# EasyEDA Pro project ProPrj_DiscoTech 6 Current_2026-05-06.epro, schematic Cue

## Sheets
1 Cue: Board Name: Cue; Create Date: 2025-11-03; Page Name: Cue; Project Name: DiscoTech 6 Current; Schematic Name: Cue; Update Date: 2025-11-16; Company: EasyEDA.com; Page Size: A4; Version: V1.0
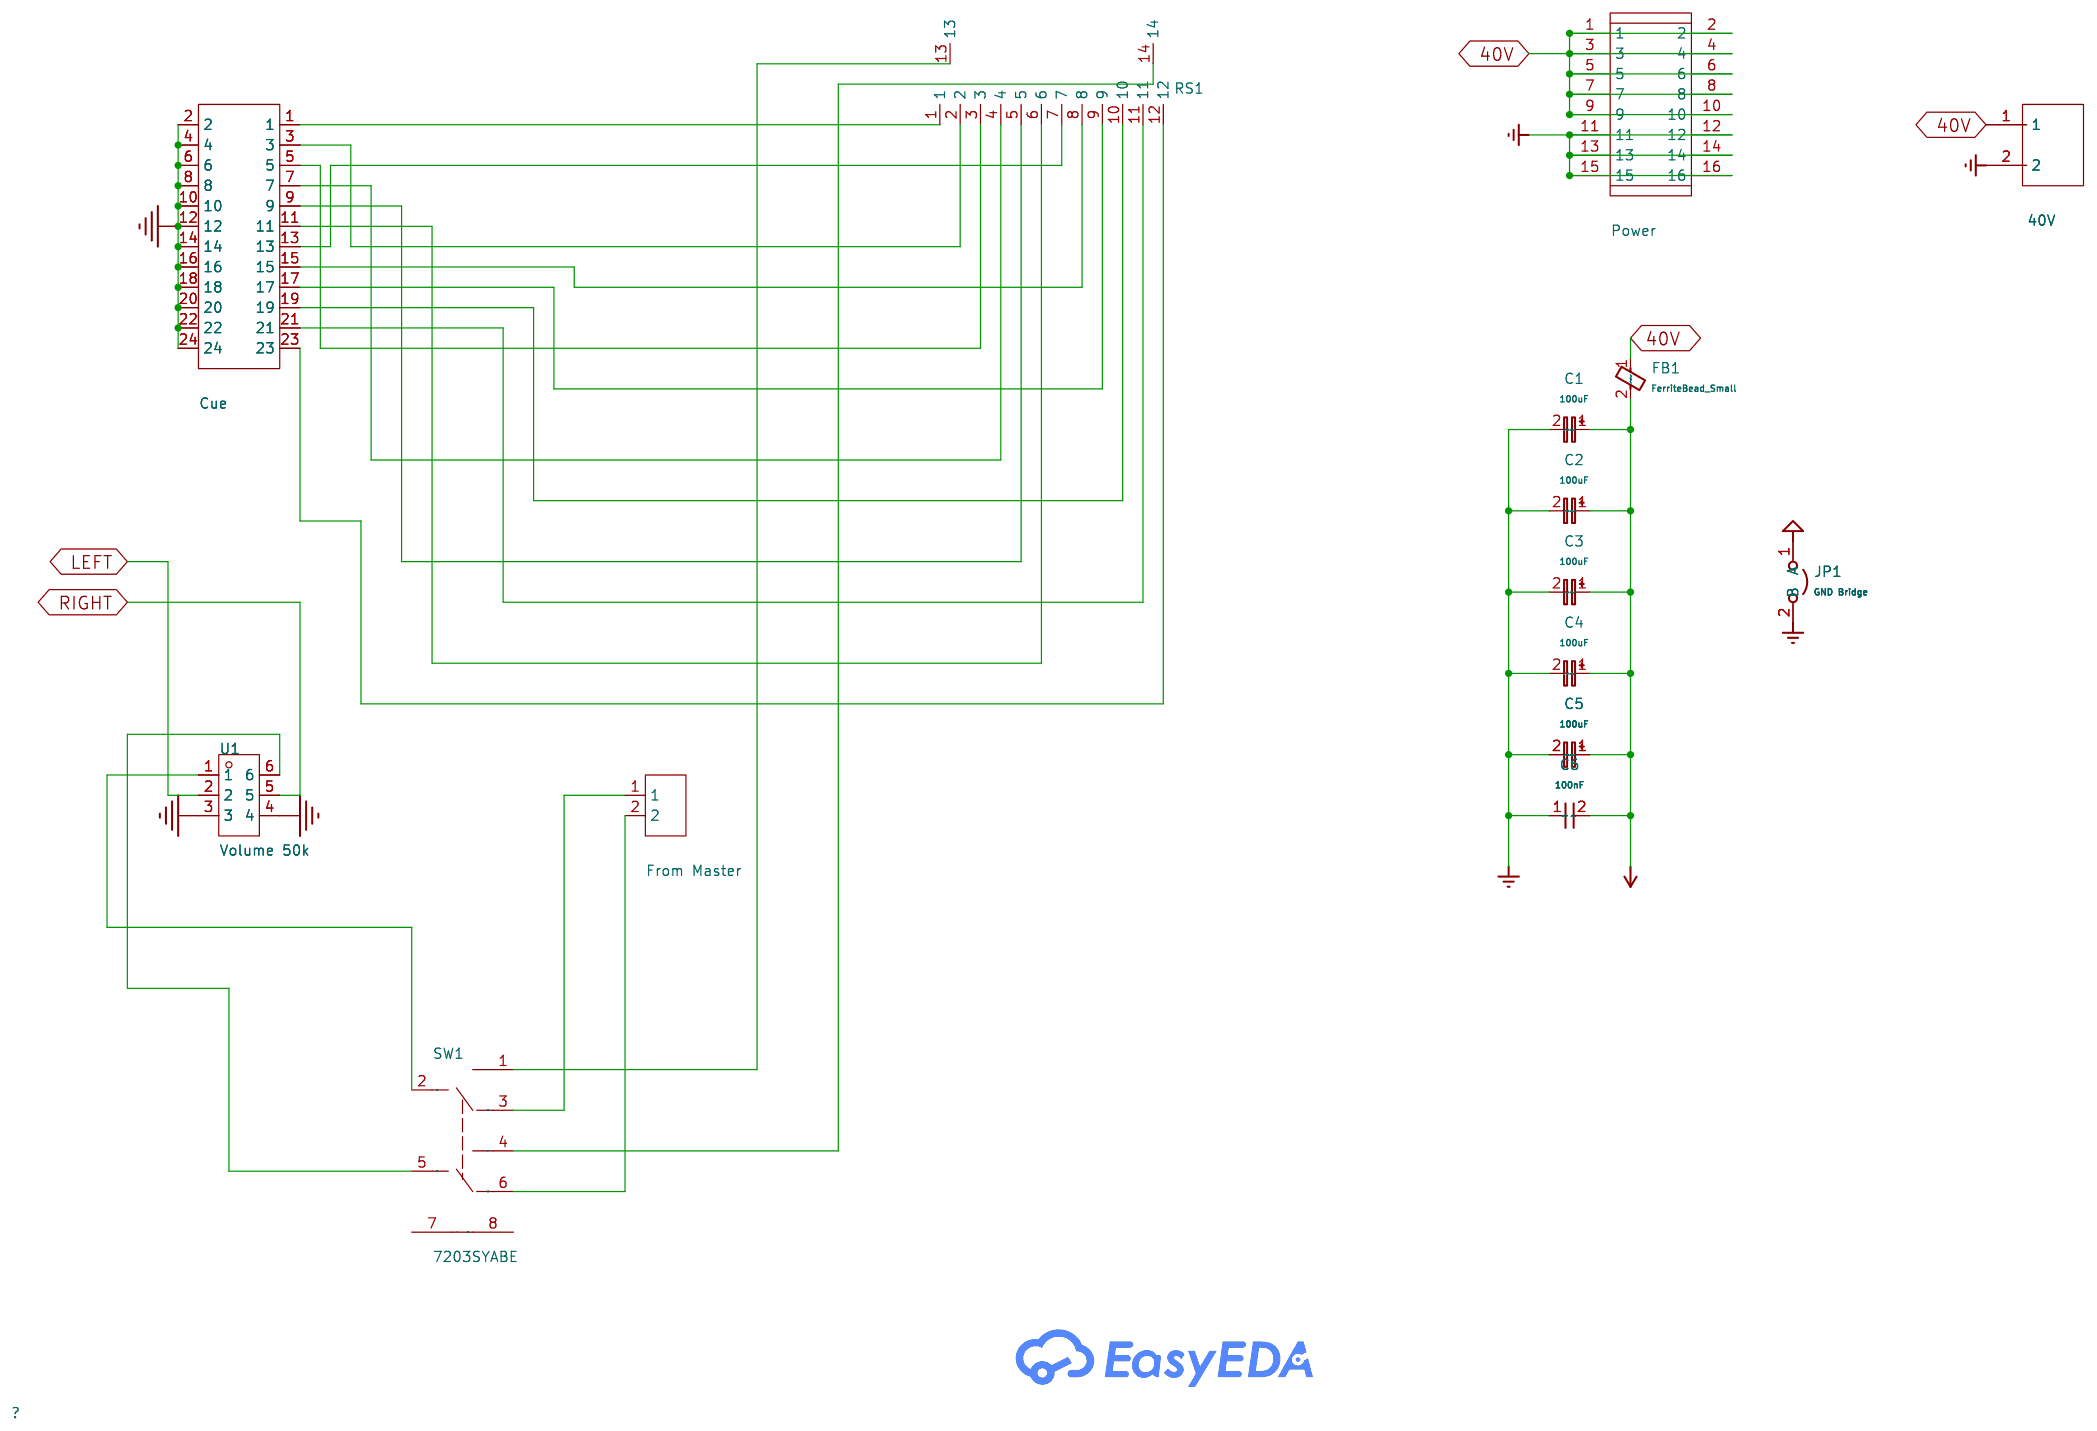
[diagram p4: Cue]
2 Amp: Create Date: 2025-11-04; Page Name: Amp; Update Date: 2026-04-02
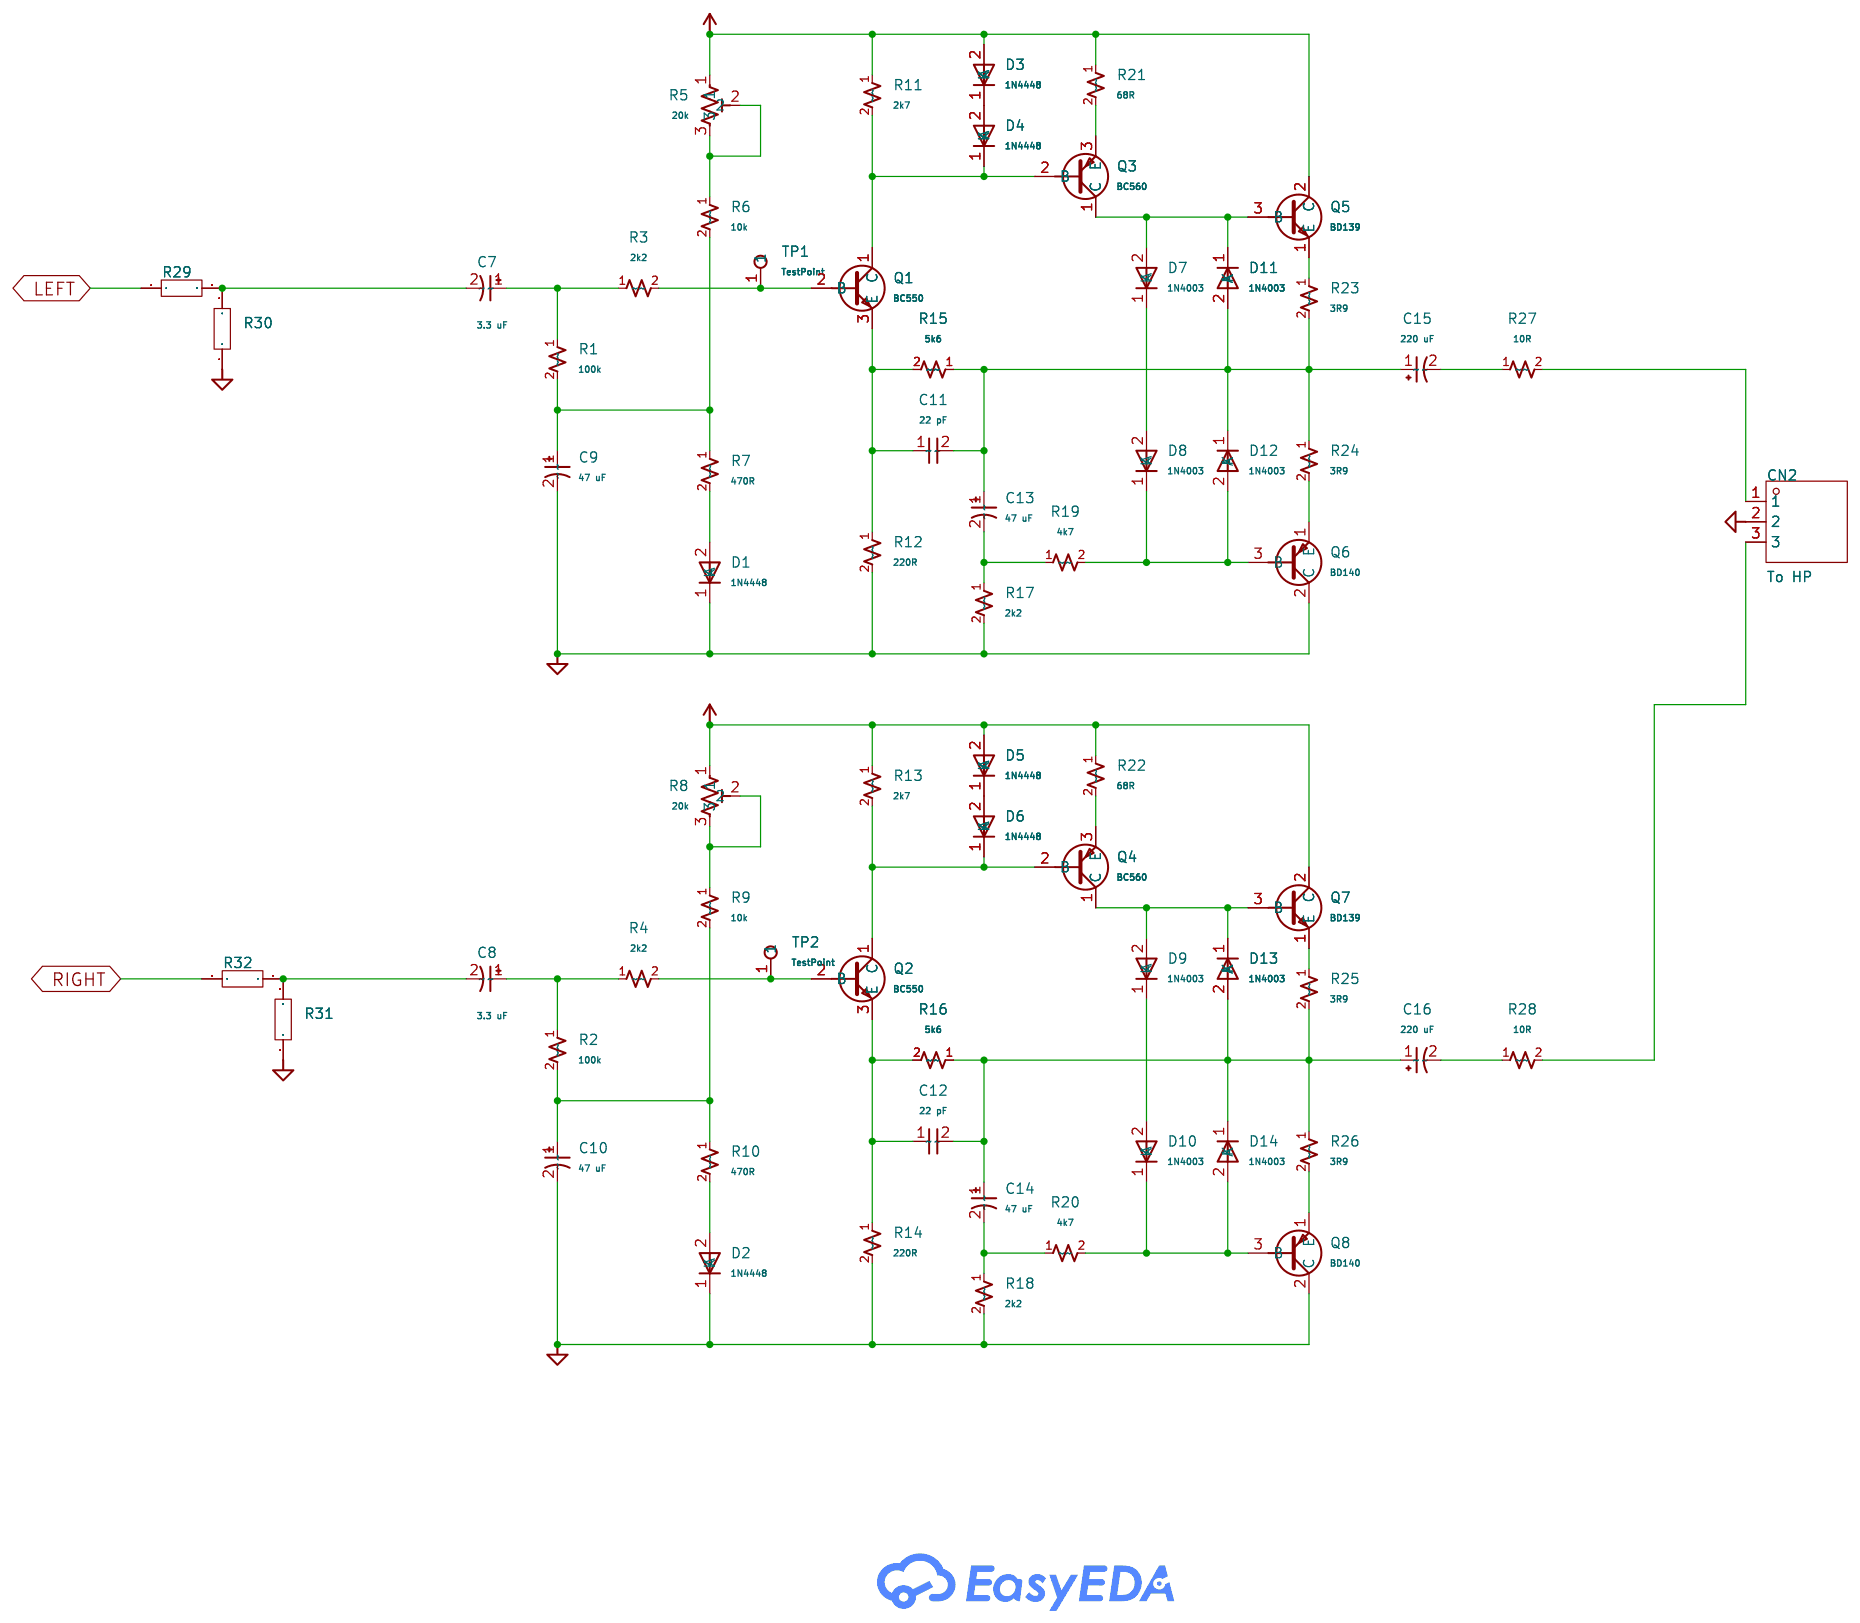
[diagram p5: Amp]

## Parts
sheet Amp
C7  3.3 uF  [Capacitor_THT:CP_Radial_Tantal_D5.0mm_P5.00mm]
C8  3.3 uF  [Capacitor_THT:CP_Radial_Tantal_D5.0mm_P5.00mm]
C9  47 uF  [Capacitor_THT:CP_Radial_D6.3mm_P2.50mm]
C10  47 uF  [Capacitor_THT:CP_Radial_D6.3mm_P2.50mm]
C11  22 pF  [Capacitor_THT:C_Disc_D3.8mm_W2.6mm_P2.50mm]
C12  22 pF  [Capacitor_THT:C_Disc_D3.8mm_W2.6mm_P2.50mm]
C13  47 uF  [Capacitor_THT:CP_Radial_D6.3mm_P2.50mm]
C14  47 uF  [Capacitor_THT:CP_Radial_D6.3mm_P2.50mm]
C15  220 uF  [Capacitor_THT:CP_Radial_D10.0mm_P5.00mm]
C16  220 uF  [Capacitor_THT:CP_Radial_D10.0mm_P5.00mm]
CN2  To HP  [CONN-TH_B3P-VH-LF-SN]
D1  1N4448  [Diode_THT:D_DO-35_SOD27_P7.62mm_Horizontal]
D2  1N4448  [Diode_THT:D_DO-35_SOD27_P7.62mm_Horizontal]
D3  1N4448  [Diode_THT:D_DO-35_SOD27_P7.62mm_Horizontal]
D4  1N4448  [Diode_THT:D_DO-35_SOD27_P7.62mm_Horizontal]
D5  1N4448  [Diode_THT:D_DO-35_SOD27_P7.62mm_Horizontal]
D6  1N4448  [Diode_THT:D_DO-35_SOD27_P7.62mm_Horizontal]
D7  1N4003  [Diode_THT:D_DO-41_SOD81_P10.16mm_Horizontal]
D8  1N4003  [Diode_THT:D_DO-41_SOD81_P10.16mm_Horizontal]
D9  1N4003  [Diode_THT:D_DO-41_SOD81_P10.16mm_Horizontal]
D10  1N4003  [Diode_THT:D_DO-41_SOD81_P10.16mm_Horizontal]
D11  1N4003  [Diode_THT:D_DO-41_SOD81_P10.16mm_Horizontal]
D12  1N4003  [Diode_THT:D_DO-41_SOD81_P10.16mm_Horizontal]
D13  1N4003  [Diode_THT:D_DO-41_SOD81_P10.16mm_Horizontal]
D14  1N4003  [Diode_THT:D_DO-41_SOD81_P10.16mm_Horizontal]
Q1  BC550  [TO-92-3_L4.8-W3.7-P2.60-L_LP0003A]
Q2  BC550  [TO-92-3_L4.8-W3.7-P2.60-L_LP0003A]
Q3  BC560  [TO-92-3_L4.8-W3.7-P2.60-L_LP0003A]
Q4  BC560  [TO-92-3_L4.8-W3.7-P2.60-L_LP0003A]
Q5  BD139  [Package_TO_SOT_THT:TO-126-3_Vertical]
Q6  BD140  [Package_TO_SOT_THT:TO-126-3_Vertical]
Q7  BD139  [Package_TO_SOT_THT:TO-126-3_Vertical]
Q8  BD140  [Package_TO_SOT_THT:TO-126-3_Vertical]
R1  100k  [Resistor_THT:R_Axial_DIN0207_L6.3mm_D2.5mm_P7.62mm_Horizontal]
R2  100k  [Resistor_THT:R_Axial_DIN0207_L6.3mm_D2.5mm_P7.62mm_Horizontal]
R3  2k2  [Resistor_THT:R_Axial_DIN0207_L6.3mm_D2.5mm_P7.62mm_Horizontal]
R4  2k2  [Resistor_THT:R_Axial_DIN0207_L6.3mm_D2.5mm_P7.62mm_Horizontal]
R5  20k  [Potentiometer_THT:Potentiometer_Bourns_3296W_Vertical]
R6  10k  [Resistor_THT:R_Axial_DIN0207_L6.3mm_D2.5mm_P7.62mm_Horizontal]
R7  470R  [Resistor_THT:R_Axial_DIN0207_L6.3mm_D2.5mm_P7.62mm_Horizontal]
R8  20k  [Potentiometer_THT:Potentiometer_Bourns_3296W_Vertical]
R9  10k  [Resistor_THT:R_Axial_DIN0207_L6.3mm_D2.5mm_P7.62mm_Horizontal]
R10  470R  [Resistor_THT:R_Axial_DIN0207_L6.3mm_D2.5mm_P7.62mm_Horizontal]
R11  2k7  [Resistor_THT:R_Axial_DIN0207_L6.3mm_D2.5mm_P7.62mm_Horizontal]
R12  220R  [Resistor_THT:R_Axial_DIN0207_L6.3mm_D2.5mm_P7.62mm_Horizontal]
R13  2k7  [Resistor_THT:R_Axial_DIN0207_L6.3mm_D2.5mm_P7.62mm_Horizontal]
R14  220R  [Resistor_THT:R_Axial_DIN0207_L6.3mm_D2.5mm_P7.62mm_Horizontal]
R15  5k6  [Resistor_THT:R_Axial_DIN0207_L6.3mm_D2.5mm_P7.62mm_Horizontal]
R16  5k6  [Resistor_THT:R_Axial_DIN0207_L6.3mm_D2.5mm_P7.62mm_Horizontal]
R17  2k2  [Resistor_THT:R_Axial_DIN0207_L6.3mm_D2.5mm_P7.62mm_Horizontal]
R18  2k2  [Resistor_THT:R_Axial_DIN0207_L6.3mm_D2.5mm_P7.62mm_Horizontal]
R19  4k7  [Resistor_THT:R_Axial_DIN0207_L6.3mm_D2.5mm_P7.62mm_Horizontal]
R20  4k7  [Resistor_THT:R_Axial_DIN0207_L6.3mm_D2.5mm_P7.62mm_Horizontal]
R21  68R  [Resistor_THT:R_Axial_DIN0207_L6.3mm_D2.5mm_P7.62mm_Horizontal]
R22  68R  [Resistor_THT:R_Axial_DIN0207_L6.3mm_D2.5mm_P7.62mm_Horizontal]
R23  3R9  [Resistor_THT:R_Axial_DIN0309_L9.0mm_D3.2mm_P12.70mm_Horizontal]
R24  3R9  [Resistor_THT:R_Axial_DIN0309_L9.0mm_D3.2mm_P12.70mm_Horizontal]
R25  3R9  [Resistor_THT:R_Axial_DIN0309_L9.0mm_D3.2mm_P12.70mm_Horizontal]
R26  3R9  [Resistor_THT:R_Axial_DIN0309_L9.0mm_D3.2mm_P12.70mm_Horizontal]
R27  10R  [Resistor_THT:R_Axial_DIN0414_L11.9mm_D4.5mm_P15.24mm_Horizontal]
R28  10R  [Resistor_THT:R_Axial_DIN0414_L11.9mm_D4.5mm_P15.24mm_Horizontal]
R29  10K  [Resistor_THT:R_Axial_DIN0207_L6.3mm_D2.5mm_P7.62mm_Horizontal]
R30  10K  [Resistor_THT:R_Axial_DIN0207_L6.3mm_D2.5mm_P7.62mm_Horizontal]
R31  10K  [Resistor_THT:R_Axial_DIN0207_L6.3mm_D2.5mm_P7.62mm_Horizontal]
R32  10K  [Resistor_THT:R_Axial_DIN0207_L6.3mm_D2.5mm_P7.62mm_Horizontal]
TP1  TestPoint  [Connector_PinHeader_2.54mm:PinHeader_1x01_P2.54mm_Vertical]
TP2  TestPoint  [Connector_PinHeader_2.54mm:PinHeader_1x01_P2.54mm_Vertical]
sheet Cue
C1  100uF  [Capacitor_THT:CP_Radial_D10.0mm_P5.00mm]
C2  100uF  [Capacitor_THT:CP_Radial_D10.0mm_P5.00mm]
C3  100uF  [Capacitor_THT:CP_Radial_D10.0mm_P5.00mm]
C4  100uF  [Capacitor_THT:CP_Radial_D10.0mm_P5.00mm]
C5  100uF  [Capacitor_THT:CP_Radial_D10.0mm_P5.00mm]
C6  100nF  [Capacitor_THT:C_Rect_L7.2mm_W2.5mm_P5.00mm_FKS2_FKP2_MKS2_MKP2]
CN1  From Master  [CONN-TH_2P-P2.50_HX-2.54MM-2P-ZZ-MS]
FB1  FerriteBead_Small  [Inductor_THT:L_Axial_L9.5mm_D4.0mm_P12.70mm_Horizontal_Fastron_SMCC]
JP1  GND Bridge  [Connector_PinHeader_2.54mm:PinHeader_1x02_P2.54mm_Vertical]
P1  Cue  [IDC-TH_24P-P2.54_ZHOURI_DC3-2.54-24PAL]
P2  Power  [CONN-TH_16P-P2.54_C9142]
P4  40V  [CONN-TH_WJ126V-5.0-2P]
RS1  2P6T  [Library:Grayhill 71 series 2P6T Rotary Switch]
SW1  7203SYABE  [SW-TH_7203SYABE]
U1  Volume 50k  [RES-ADJ-TH_RK27112A0A16]

## Library data of the parts
C7-C10 C13-C16 = Device_C_Polarized_Small_US: Polarized capacitor, small US symbol; Users: REF**
C6 C11 C12 = Device_C_Small: Unpolarized capacitor, small symbol; Users: REF**
CN2 = B3P-VH(LF)(SN): Pins Structure:1x3P Pitch:3.96mm Mounting Style:Direct Insert Reference Series:VH Number of Pins:3P Number of Rows:1 Number of PINs Per Row:3 Row Spacing:- Current Rating (Max):10A Contact Material:Brass Contact Plating:Tin Operating Temperature Range:-25; LCSC Part Name: 1x3P 间距:3.96mm 直插 系列:VH; Supplier Part: C160316; Manufacturer: JST; Supplier Footprint: 插件,P=3.96mm; JLCPCB Part Class: Extended Part; Datasheet: https://atta.szlcsc.com/upload/public/pdf/source/20181223/C160316_7785062CEF1934DB27BD79CEB62E0E2D.pdf; Supplier: LCSC; Pins Structure: 1x3P; Pitch: 3.96mm; Mounting Style: Direct Insert; Reference Series: VH; Number of Pins: 3P; Number of Rows: 1; Number of PINs Per Row: 3; Current Rating (Max): 10A; Contact Material: Brass; Contact Plating: Tin; Operating Temperature Range: -25℃~+85℃; Rated Voltage (Max): 250V; Plastic Material: PA66; Flame Retardant Rating: UL94V-0; Colour: White; Z-Height of the Board: 9.4mm; X-Length of Bottom Edge on Board (Spacing Line): 11.82mm; Y-Width of Bottom Edge on Board: 8.5mm
D1-D6 = Diode_1N4448: 100V 0.15A High-speed standard diode, DO-35; Users: K; datasheet: https://assets.nexperia.com/documents/data-sheet/1N4148_1N4448.pdf; sim_device: D; sim_pins: 1=K 2=A; User doc link: https://assets.nexperia.com/documents/data-sheet/1N4148_1N4448.pdf; Sim.Device: D; Sim.Pins: 1=K 2=A
D7-D14 = Diode_1N4003: 200V 1A General Purpose Rectifier Diode, DO-41; Users: REF**; datasheet: http://www.vishay.com/docs/88503/1n4001.pdf; sim_device: D; sim_pins: 1=K 2=A; User doc link: http://www.vishay.com/docs/88503/1n4001.pdf; Sim.Device: D; Sim.Pins: 1=K 2=A
Q1 Q2 = Transistor_BJT_BC550: 0.1A Ic, 45V Vce, Small Signal NPN Transistor, TO-92; User doc link: https://www.onsemi.com/pub/Collateral/BC550-D.pdf
Q3 Q4 = Transistor_BJT_BC560: 0.1A Ic, 45V Vce, PNP Small Signal Transistor, TO-92; Users: REF**; datasheet: https://www.onsemi.com/pub/Collateral/BC550-D.pdf; User doc link: https://www.onsemi.com/pub/Collateral/BC556BTA-D.pdf
Q5 Q7 = Transistor_BJT_BD139: 1.5A Ic, 80V Vce, Low Voltage Transistor, TO-126; User doc link: http://www.st.com/internet/com/TECHNICAL_RESOURCES/TECHNICAL_LITERATURE/DATASHEET/CD00001225.pdf
Q6 Q8 = Transistor_BJT_BD140: 1.5A Ic, 80V Vce, Low Voltage Transistor, TO-126; Users: REF**; datasheet: http://www.st.com/internet/com/TECHNICAL_RESOURCES/TECHNICAL_LITERATURE/DATASHEET/CD00001225.pdf; User doc link: http://www.st.com/internet/com/TECHNICAL_RESOURCES/TECHNICAL_LITERATURE/DATASHEET/CD00001225.pdf
R1-R4 R6 R7 R9-R28 = Device_R_Small_US: Resistor, small US symbol; Users: REF**
R5 R8 = Device_R_Potentiometer_Trim_US: Trim-potentiometer, US symbol; Users: REF**
R29-R32 = Res_0603: Supplier Footprint: 0603
TP1 TP2 = Connector_TestPoint: test point; Users: REF**
C1-C5 = Device_C_Polarized_Small: Polarized capacitor, small symbol; Users: REF**
CN1 = HX-XH2.54-2PZZ: Pins Structure:1x2P Pitch:2.54mm Mounting Type:Straight Reference Series:XH Number of Pins:2P Number of Rows:1 Number of PINs Per Row:2 Row Spacing:- Current Rating:3A Contact Material:Brass Contact Plating:Tin Operating Temperature:-25℃~+85℃ Operating Te; LCSC Part Name: 1x2P 间距:2.5mm 直插 系列:XH; Supplier Part: C42391660; Manufacturer: hanxia(韩下); Supplier Footprint: 插件,P=2.5mm; JLCPCB Part Class: Extended Part; Datasheet: https://item.szlcsc.com/datasheet/HX-XH2.54-2PZZ/44326932.html; Supplier: LCSC; Pins Structure: 1x2P; Pitch: 2.54mm; Mounting Type: Straight; Reference Series: XH; Number of Pins: 2P; Number of Rows: 1; Number of PINs Per Row: 2; Current Rating: 3A; Contact Material: Brass; Contact Plating: Tin; Operating Temperature: -25℃~+85℃; Voltage Rating: 250V; Plastic Material: PA66; Flame Retardant Rating: UL94V-0; Color: White
FB1 = Device_FerriteBead_Small: Ferrite bead, small symbol; Users: REF**
JP1 = Jumper_Jumper_2_Open: Jumper, 2-pole, open; Users: REF**
P1 = DS1013-24RSiB-B-0: Connector Type:IDC Header Pitch:2.54mm Number of Positions or Pins:2x12P Holder Type:Right Angle Number of Rows:2 Number of PINs Per Row:12; LCSC Part Name: 2.54mm 2x12P 排数:2 每排P数:12; Supplier Part: C7430325; Manufacturer: CONNFLY; Supplier Footprint: 弯插,P=2.54mm; JLCPCB Part Class: Extended Part; Datasheet: https://item.szlcsc.com/datasheet/DS1013-24RSiB-B-0/8429959.html; Supplier: LCSC; Connector Type: IDC Header; Pitch: 2.54mm; Number of Positions or Pins: 2x12P; Holder Type: Right Angle; Number of Rows: 2; Number of PINs Per Row: 12; Row Spacing: 2.54mm
P2 = 2.54-2*8P弯简牛: Connector Type:IDC Header Pitch:2.54mm Number of Positions or Pins:2x8P Holder Type:Right Angle Row Spacing:2.54mm Number of Rows:2 Number of PINs Per Row:8 Contact Material:- Contact Plating:-; LCSC Part Name: 2.54mm 2x8P 排数:2 每排P数:8; Supplier Part: C9142; Manufacturer: BOOMELE(博穆精密); Supplier Footprint: 弯插,P=2.54mm; JLCPCB Part Class: Extended Part; Datasheet: https://item.szlcsc.com/datasheet/2.54-2*8P%25E5%25BC%25AF%25E7%25AE%2580%25E7%2589%259B/9665.html; Supplier: LCSC; Connector Type: IDC Header; Pitch: 2.54mm; Number of Positions or Pins: 2x8P; Holder Type: Right Angle; Row Spacing: 2.54mm; Number of Rows: 2; Number of PINs Per Row: 8
P4 = WJ126V-5.0-2P: Structure:1x2P Pitch:5mm Color:Green Mounting Style:Straight Current Rating (Max):18A Voltage Rating (Max):250V Number of Pins:2P Number of Rows:1 Wire Gauge - AWG:14~26 Wire Gauge - AWG:14~26 Wire Gauge - mm2:2.5 Wire Gauge - mm2:2.5 Number of PINs Per R; LCSC Part Name: 5mm 1x2P 排数:1 每排P数:2 直插; Supplier Part: C8404; Manufacturer: KANGNEX(康奈克斯电气); Supplier Footprint: 插件,P=5mm; JLCPCB Part Class: Extended Part; Datasheet: https://atta.szlcsc.com/upload/public/pdf/source/20191225/C8404_8F52D87DF851D149A4DEA9BD9FA83F9A.pdf; Supplier: LCSC; Structure: 1x2P; Pitch: 5mm; Color: Green; Mounting Style: Straight; Current Rating (Max): 18A; Voltage Rating (Max): 250V; Number of Pins: 2P; Number of Rows: 1; Wire Gauge - AWG: 14~26; Wire Gauge - mm2: 2.5; Number of PINs Per Row: 2; Operating Temperature Range: -40℃~+105℃
RS1 = New_Library_G71_DP6T
SW1 = 7203SYABE: Circuit:DPDT Voltage Rating (AC):20V Voltage Rating (DC):20V Actuator Type:Cylinder Lever Termination Style:PC Pin Mounting Type:Through Hole Operating Temperature:-30℃~+85℃ Operating Temperature:-30℃~+85℃; LCSC Part Name: 5件套 7203SYABE; Supplier Part: C2809783; Manufacturer: C&K; Supplier Footprint: 插件; JLCPCB Part Class: Extended Part; Datasheet: https://item.szlcsc.com/datasheet/7203SYABE/2953069.html; Supplier: LCSC; Circuit: DPDT; Voltage Rating (AC): 20V; Voltage Rating (DC): 20V; Actuator Type: Cylinder Lever; Termination Style: PC Pin; Mounting Type: Through Hole; Operating Temperature: -30℃~+85℃
U1 = RK27112A0A16: Resistance: Tolerance:±20% Tolerance:±20% Rated Voltage:- Power(Watts):- Turns:-; LCSC Part Name: 100kΩ ±20% 3件套; Supplier Part: C470508; Manufacturer: ALPSALPINE(阿尔卑斯阿尔派); Supplier Footprint: DIP-6P,27x24.5mm; JLCPCB Part Class: Extended Part; Datasheet: https://atta.szlcsc.com/upload/public/pdf/source/20191216/C470509_1AC214E673023FF0853974852A92149F.pdf; Supplier: LCSC; Tolerance: ±20%

## Nets
40V: FB1.1 P2.1 P2.2 P2.3 P2.4 P2.5 P2.6 P2.7 P2.8 P2.9 P2.10 P4.1
GNDREF: C1.2 C2.2 C3.2 C4.2 C5.2 C6.1 JP1.2(B) P2.11 P2.12 P2.13 P2.14 P2.15 P2.16 P4.2
GNDS: C9.2 C10.2 CN2.2 D1.1(K) D2.1(K) JP1.1(A) P1.2 P1.4 P1.6 P1.8 P1.10 P1.12 P1.14 P1.16 P1.18 P1.20 P1.22 P1.24 Q6.2(C) Q8.2(C) R12.2 R14.2 R17.2 R18.2 R30.1 R31.1 U1.3 U1.4
LEFT: R29.1 U1.2
RIGHT: R32.2 U1.5
VDC: C1.1 C2.1 C3.1 C4.1 C5.1 C6.2 D3.2(A) D5.2(A) FB1.2 Q5.2(C) Q7.2(C) R5.1 R8.1 R11.1 R13.1 R21.1 R22.1
$1N811: P1.1 RS1.1
$1N815: P1.3 RS1.2
$1N821: P1.5 RS1.3
$1N827: P1.7 RS1.4
$1N833: P1.9 RS1.5
$1N839: P1.11 RS1.6
$1N845: P1.13 RS1.7
$1N851: P1.15 RS1.8
$1N857: P1.17 RS1.9
$1N863: P1.19 RS1.10
$1N869: P1.21 RS1.11
$1N875: P1.23 RS1.12
$1N2652: SW1.2 U1.1
$1N2658: SW1.5 U1.6
$1N5183: RS1.13 SW1.1
$1N5191: RS1.14 SW1.4
$1N5223: CN1.1 SW1.3
$1N5232: CN1.2 SW1.6
$2N1850: D4.1(K) Q1.1(C) Q3.2(B) R11.2
$2N1856: D7.2(A) D11.1(K) Q3.1(C) Q5.3(B)
$2N1862: R8.2 R8.3 R9.1
$2N1868: D8.1(K) D12.2(A) Q6.3(B) R19.2
$2N1884: C11.1 Q1.3(E) R12.1 R15.2
$2N1890: Q3.3(E) R21.2
$2N1892: C11.2 C13.1 C15.1 D11.2(A) D12.1(K) R15.1 R23.2 R24.1
$2N1924: C12.1 Q2.3(E) R14.1 R16.2
$2N1930: C10.1 R2.2 R9.2 R10.1
$2N1936: C12.2 C14.1 C16.1 D13.2(A) D14.1(K) R16.1 R25.2 R26.1
$2N1958: C7.1 R1.1 R3.1
$2N1962: Q8.1(E) R26.2
$2N1964: Q1.2(B) R3.2 TP1.1
$2N1975: C13.2 R17.1 R19.1
$2N1979: C14.2 R18.1 R20.1
$2N1983: D2.2(A) R10.2
$2N1985: R5.2 R5.3 R6.1
$2N2000: C8.1 R2.1 R4.1
$2N2004: D9.2(A) D13.1(K) Q4.1(C) Q7.3(B)
$2N2010: D10.1(K) D14.2(A) Q8.3(B) R20.2
$2N2016: D9.1(K) D10.2(A)
$2N2018: Q2.2(B) R4.2 TP2.1
$2N2021: Q7.1(E) R25.1
$2N2023: C16.2 R28.1
$2N2025: D6.1(K) Q2.1(C) Q4.2(B) R13.2
$2N2031: C9.1 R1.2 R6.2 R7.1
$2N2037: Q5.1(E) R23.1
$2N2039: D7.1(K) D8.2(A)
$2N2041: C15.2 R27.1
$2N2043: Q6.1(E) R24.2
$2N2045: D1.2(A) R7.2
$2N2047: Q4.3(E) R22.2
$2N2049: D5.1(K) D6.2(A)
$2N2051: D3.1(K) D4.2(A)
$2N2061: CN2.1 R27.2
$2N2069: CN2.3 R28.2
$2N9719: C7.2 R29.2 R30.2
$2N9761: C8.2 R31.2 R32.1

Not connected (* = marked no-connect by the designer): SW1 7 8
